# Altium schematic sheet MiniSTM32_1.SchDoc: Mini_Core
size A4; DrawnBy: Sean
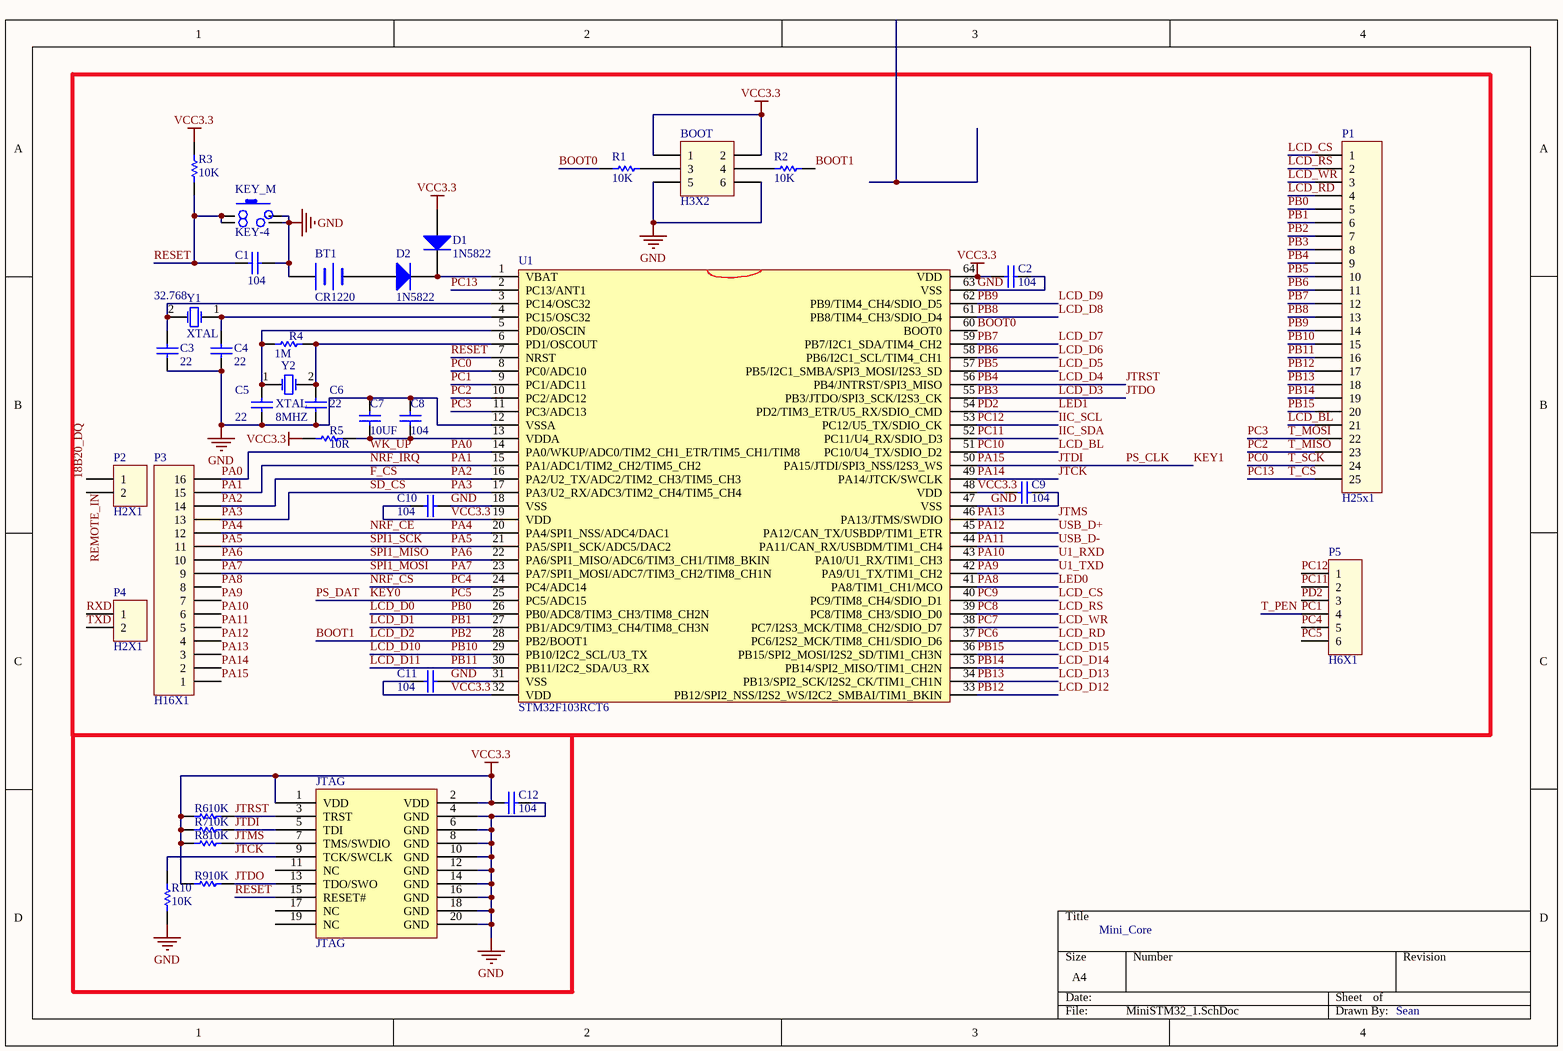
[diagram p0: MiniSTM32_1.SchDoc]

## Parts
BOOT  H3X2  [H2.54-2X3]
BT1  CR1220  [CR1220]
C1  Cap  [CAP[0603]]  (value not drawn)
C2  Cap  [CAP[0603]]  (value not drawn)
C3  Cap  [CAP[0603]]  (value not drawn)
C4  Cap  [CAP[0603]]  (value not drawn)
C5  Cap  [CAP[0805]]  (value not drawn)
C6  Cap  [CAP[0805]]  (value not drawn)
C7  Cap  [CAP[1206]]  (value not drawn)
C8  Cap  [CAP[0603]]  (value not drawn)
C9  Cap  [CAP[0603]]  (value not drawn)
C10  Cap  [CAP[0603]]  (value not drawn)
C11  Cap  [CAP[0603]]  (value not drawn)
C12  Cap  [CAP[0603]]  (value not drawn)
D1  1N5822  [1N4733]
D2  1N5822  [1N4733]
JTAG  JTAG  [JTAG]
KEY_M  KEY-4  [KEY-4(DIP)]
P1  H25x1  [H2.54-1X25]
P2  H2X1  [H2.54-1X2]
P3  H16X1  [H2.54-1X16]
P4  H2X1  [H2.54-1X2]
P5  H6X1  [H2.54-1X6]
R1  Res  [RES[0603]]  (value not drawn)
R2  Res  [RES[0603]]  (value not drawn)
R3  Res  [RES[0603]]  (value not drawn)
R4  Res  [RES[0603]]  (value not drawn)
R5  Res  [RES[0603]]  (value not drawn)
R6  Res  [RES[0603]]  (value not drawn)
R7  Res  [RES[0603]]  (value not drawn)
R8  Res  [RES[0603]]  (value not drawn)
R9  Res  [RES[0603]]  (value not drawn)
R10  Res  [RES[0603]]  (value not drawn)
U1  STM32F103RCT6  [LQFP-64]
Y1  XTAL  [XTAL-32768_2]
Y2  XTAL  [XTAL]

## Nets
GND: BOOT.5 BOOT.6 BT1.1(+) C1.2 C2.2 C3.1 C4.1 C5.1 C6.1 C7.2 C8.2 C9.2 C10.1 C11.1 C12.1 JTAG.4(GND) JTAG.6(GND) JTAG.8(GND) JTAG.10(GND) JTAG.12(GND) JTAG.14(GND) JTAG.16(GND) JTAG.18(GND) JTAG.20(GND) KEY_M.3 KEY_M.4 R10.2 U1.12(VSSA) U1.18(VSS) U1.31(VSS) U1.47(VSS) U1.63(VSS)
VCC3.3: BOOT.1 BOOT.2 C2.1 C9.1 C10.2 C11.2 C12.2 D1.1(A) JTAG.1(VDD) JTAG.2(VDD) R3.2 R5.2 R6.2 R7.2 R8.2 R9.2 U1.19(VDD) U1.32(VDD) U1.48(VDD) U1.64(VDD)
18B20_DQ: P2.1
BOOT0: R1.1 U1.60(BOOT0)
BOOT1: P1.7 R2.2 U1.28(PB2/BOOT1)  [also labelled LCD_D2, PB2]
F_CS: P3.14 U1.16(PA2/U2_TX/ADC2/TIM2_CH3/TIM5_CH3)  [also labelled PA2]
IIC_SCL: P5.1 U1.53(PC12/U5_TX/SDIO_CK)  [also labelled PC12]
IIC_SDA: P5.2 U1.52(PC11/U4_RX/SDIO_D3)  [also labelled PC11]
JTCK: JTAG.9(TCK/SWCLK) P3.2 R10.1 U1.49(PA14/JTCK/SWCLK)  [also labelled PA14]
JTDI: JTAG.5(TDI) P3.1 R7.1 U1.50(PA15/JTDI/SPI3_NSS/I2S3_WS)  [also labelled KEY1, PA15, PS_CLK]
JTDO: JTAG.13(TDO/SWO) P1.8 R9.1 U1.55(PB3/JTDO/SPI3_SCK/I2S3_CK)  [also labelled LCD_D3, PB3]
JTMS: JTAG.7(TMS/SWDIO) P3.3 R8.1 U1.46(PA13/JTMS/SWDIO)  [also labelled PA13]
JTRST: JTAG.3(TRST) P1.9 R6.1 U1.56(PB4/JNTRST/SPI3_MISO)  [also labelled LCD_D4, PB4]
KEY0: P5.6 U1.25(PC5/ADC15)  [also labelled PC5, PS_DAT]
LCD_BL: P1.21 U1.51(PC10/U4_TX/SDIO_D2)  [also labelled PC10]
LCD_CS: P1.1 U1.40(PC9/TIM8_CH4/SDIO_D1)  [also labelled PC9]
LCD_D0: P1.5 U1.26(PB0/ADC8/TIM3_CH3/TIM8_CH2N)  [also labelled PB0]
LCD_D1: P1.6 U1.27(PB1/ADC9/TIM3_CH4/TIM8_CH3N)  [also labelled PB1]
LCD_D5: P1.10 U1.57(PB5/I2C1_SMBA/SPI3_MOSI/I2S3_SD)  [also labelled PB5]
LCD_D6: P1.11 U1.58(PB6/I2C1_SCL/TIM4_CH1)  [also labelled PB6]
LCD_D7: P1.12 U1.59(PB7/I2C1_SDA/TIM4_CH2)  [also labelled PB7]
LCD_D8: P1.13 U1.61(PB8/TIM4_CH3/SDIO_D4)  [also labelled PB8]
LCD_D9: P1.14 U1.62(PB9/TIM4_CH4/SDIO_D5)  [also labelled PB9]
LCD_D10: P1.15 U1.29(PB10/I2C2_SCL/U3_TX)  [also labelled PB10]
LCD_D11: P1.16 U1.30(PB11/I2C2_SDA/U3_RX)  [also labelled PB11]
LCD_D12: P1.17 U1.33(PB12/SPI2_NSS/I2S2_WS/I2C2_SMBAI/TIM1_BKIN)  [also labelled PB12]
LCD_D13: P1.18 U1.34(PB13/SPI2_SCK/I2S2_CK/TIM1_CH1N)  [also labelled PB13]
LCD_D14: P1.19 U1.35(PB14/SPI2_MISO/TIM1_CH2N)  [also labelled PB14]
LCD_D15: P1.20 U1.36(PB15/SPI2_MOSI/I2S2_SD/TIM1_CH3N)  [also labelled PB15]
LCD_RD: P1.4 U1.37(PC6/I2S2_MCK/TIM8_CH1/SDIO_D6)  [also labelled PC6]
LCD_RS: P1.2 U1.39(PC8/TIM8_CH3/SDIO_D0)  [also labelled PC8]
LCD_WR: P1.3 U1.38(PC7/I2S3_MCK/TIM8_CH2/SDIO_D7)  [also labelled PC7]
LED0: P3.8 U1.41(PA8/TIM1_CH1/MCO)  [also labelled PA8]
LED1: P5.3 U1.54(PD2/TIM3_ETR/U5_RX/SDIO_CMD)  [also labelled PD2]
NRF_CE: P3.12 U1.20(PA4/SPI1_NSS/ADC4/DAC1)  [also labelled PA4]
NRF_CS: P5.5 U1.24(PC4/ADC14)  [also labelled PC4]
NRF_IRQ: P3.15 U1.15(PA1/ADC1/TIM2_CH2/TIM5_CH2)  [also labelled PA1]
PA0: P3.16 U1.14(PA0/WKUP/ADC0/TIM2_CH1_ETR/TIM5_CH1/TIM8)  [also labelled WK_UP]
PA3: P3.13 U1.17(PA3/U2_RX/ADC3/TIM2_CH4/TIM5_CH4)  [also labelled SD_CS]
PA5: P3.11 U1.21(PA5/SPI1_SCK/ADC5/DAC2)  [also labelled SPI1_SCK]
PA6: P3.10 U1.22(PA6/SPI1_MISO/ADC6/TIM3_CH1/TIM8_BKIN)  [also labelled SPI1_MISO]
PA7: P3.9 U1.23(PA7/SPI1_MOSI/ADC7/TIM3_CH2/TIM8_CH1N)  [also labelled SPI1_MOSI]
PA9: P3.7 U1.42(PA9/U1_TX/TIM1_CH2)  [also labelled U1_TXD]
PA10: P3.6 U1.43(PA10/U1_RX/TIM1_CH3)  [also labelled U1_RXD]
PA11: P3.5 U1.44(PA11/CAN_RX/USBDM/TIM1_CH4)  [also labelled USB_D-]
PA12: P3.4 U1.45(PA12/CAN_TX/USBDP/TIM1_ETR)  [also labelled USB_D+]
PC0: P1.24 U1.8(PC0/ADC10)  [also labelled T_SCK]
PC1: P5.4 U1.9(PC1/ADC11)  [also labelled T_PEN]
PC2: P1.23 U1.10(PC2/ADC12)  [also labelled T_MISO]
PC3: P1.22 U1.11(PC3/ADC13)  [also labelled T_MOSI]
PC13: P1.25 U1.2(PC13/ANT1)  [also labelled T_CS]
REMOTE_IN: P2.2
RESET: C1.1 JTAG.15(RESET#) KEY_M.1 KEY_M.2 R3.1 U1.7(NRST)
RXD: P4.1
TXD: P4.2
NetBOOT_3: BOOT.3 R1.2
NetBOOT_4: BOOT.4 R2.1
NetBT1_2: BT1.2(-) D2.1(A)
NetC3_2: C3.2 U1.3(PC14/OSC32) Y1.2(OSC2)
NetC4_2: C4.2 U1.4(PC15/OSC32) Y1.1(OSC1)
NetC5_2: C5.2 R4.2 U1.5(PD0/OSCIN) Y2.1(OSC1)
NetC6_2: C6.2 R4.1 U1.6(PD1/OSCOUT) Y2.2(OSC2)
NetC7_1: C7.1 C8.1 R5.1 U1.13(VDDA)
NetD1_2: D1.2(K) D2.2(K) U1.1(VBAT)

Not connected (* = marked no-connect by the designer): JTAG 11(NC) 17(NC) 19(NC)

## Notes on the sheet
- (in symbol Cap) 104; 22; 10UF
- (in symbol Res) 10K; 1M; 10R
- (in symbol XTAL) 32.768; 8MHZ

## Library data of the parts
BT1 = BATTERY